# Altium schematic sheet UA3REO.SchDoc: UA3REO
size A4; DocumentNumber: 1; Revision: 1.8.2; SheetNumber: 1; SheetTotal: 19
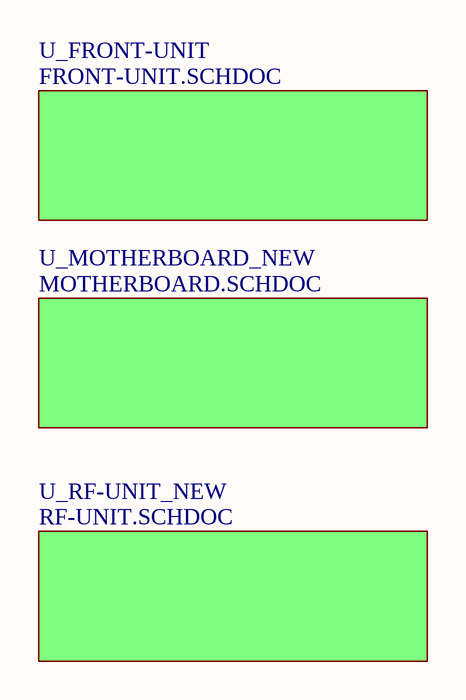
[diagram p0: UA3REO.SchDoc]

## Sub-sheets
U_FRONT-UNIT = FRONT-UNIT.SCHDOC: no entries
U_MOTHERBOARD_NEW = MOTHERBOARD.SCHDOC: no entries
U_RF-UNIT_NEW = RF-UNIT.SCHDOC: no entries

## Notes on the sheet
- Title
- Size:
- Date:
- A4
- Number:
- Time:
- Revision:
- Sheet
- of
- File: